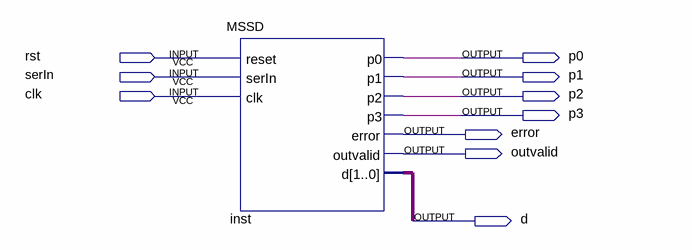
[diagram p0: schematic sheet]
// Quartus schematic symbol_mssd.bdf as structural Verilog: 1 symbols, 10 pins
module symbol_mssd (
  input  rst,
  input  serIn,
  input  clk,
  output p0,
  output p1,
  output p2,
  output p3,
  output error,
  output outvalid,
  output d
);

  wire [1:0] inst_d;

  MSSD inst (
    .reset(rst), .serIn(serIn), .clk(clk), .p0(p0), .p1(p1), .p2(p2), .p3(p3), .error(error),
    .outvalid(outvalid), .d(inst_d));
endmodule
